# EAGLE design control (EAGLE 6.6.0)
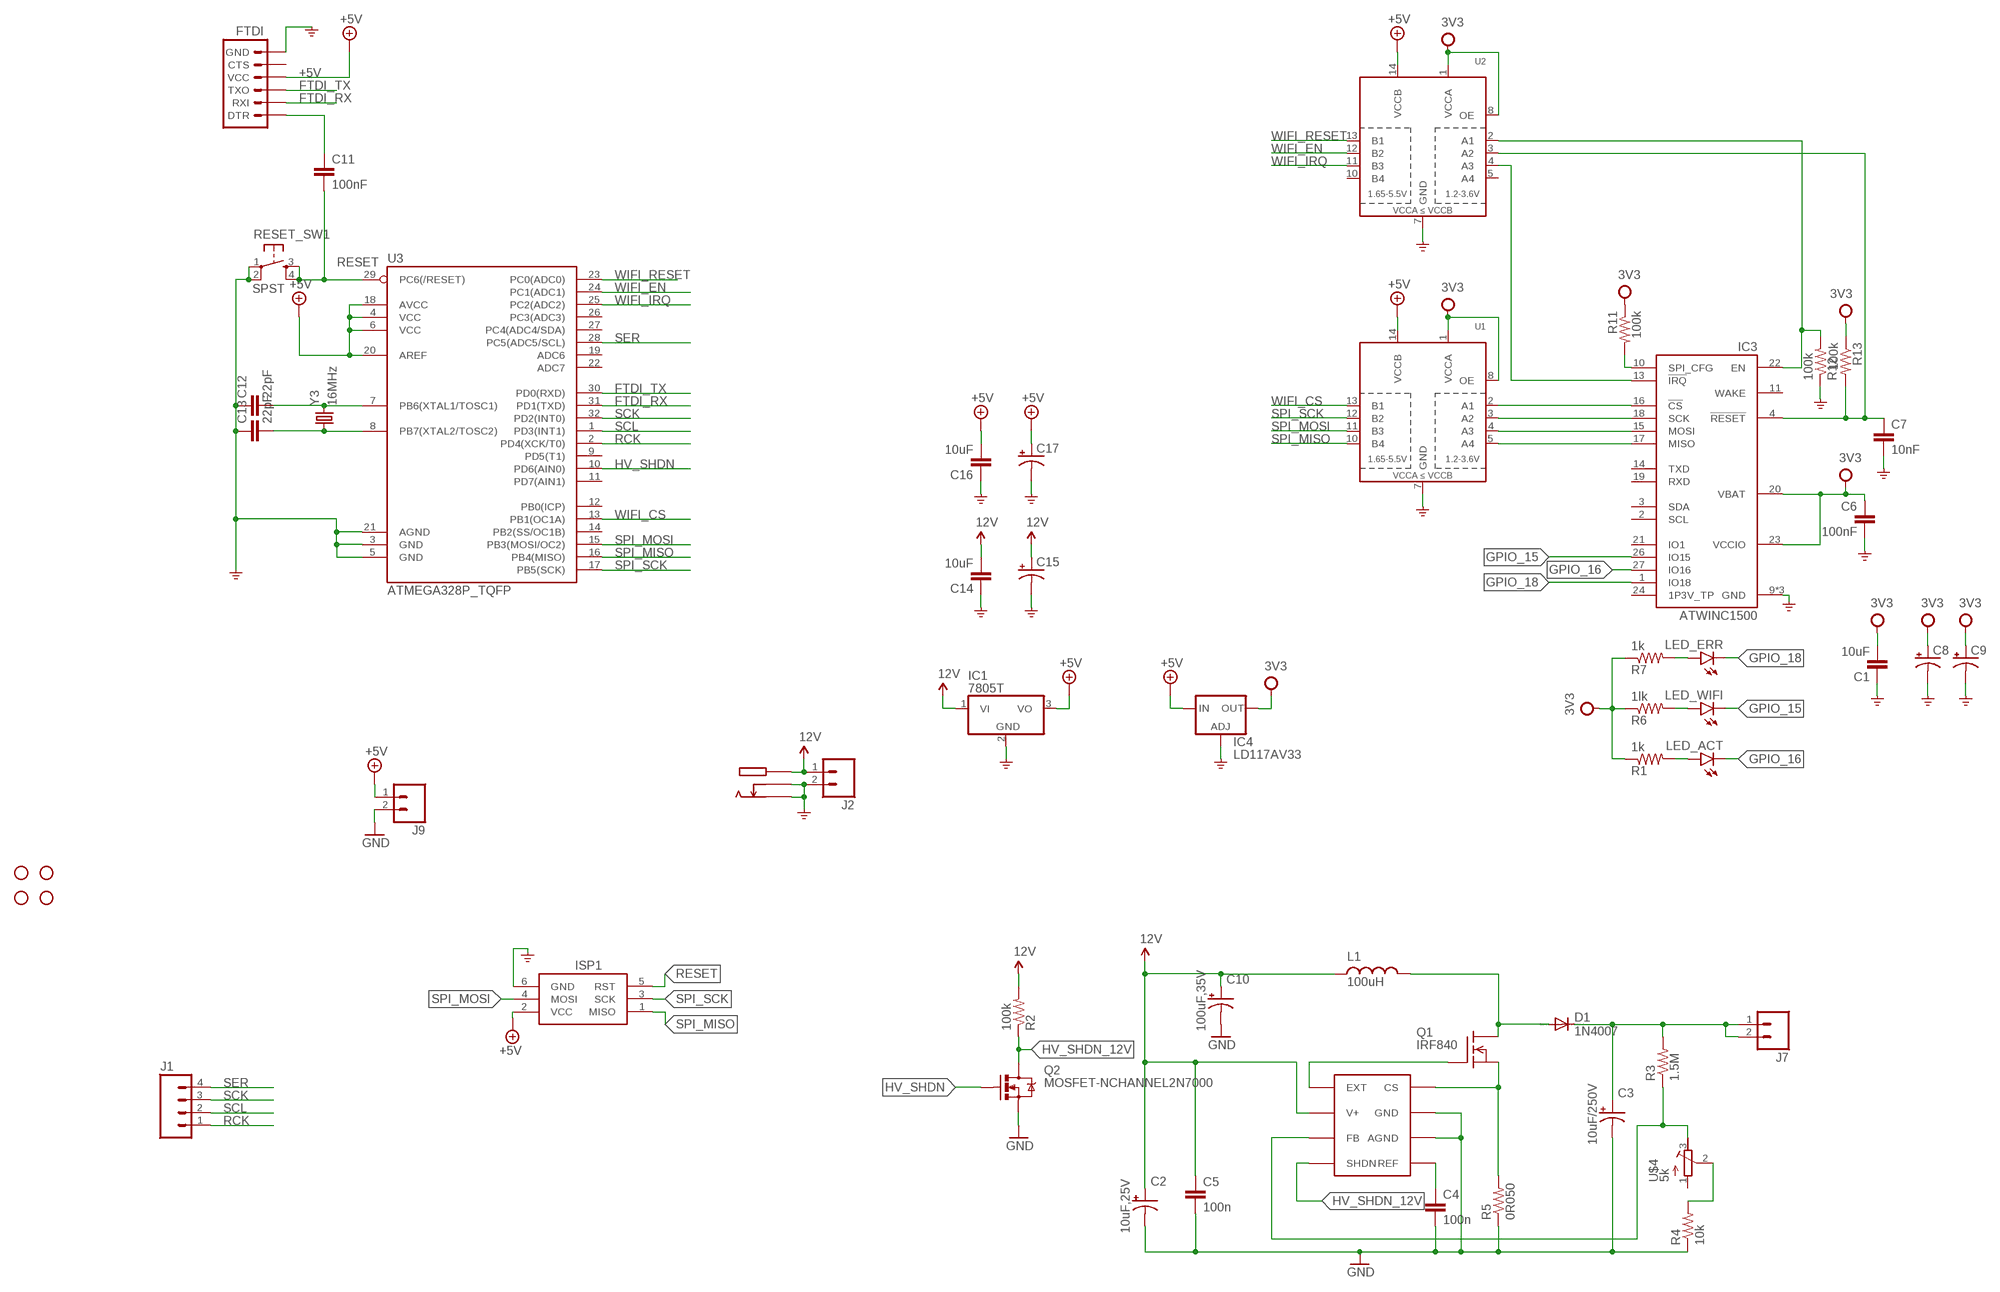
[diagram p0: schematic, sheet 1]

## Parts
C1  10uF  CAP0805  [0805]
C2  10uF,25V  CAP_POLPTH2  [CPOL-RADIAL-10UF-25V]
C3  10uF/250V  CAP_POLPTH2  [CPOL-RADIAL-10UF-25V]
C4  100n  CAPPTH  [CAP-PTH-SMALL]
C5  100n  CAPPTH  [CAP-PTH-SMALL]
C6  100nF  CAP0805  [0805]
C7  10nF  CAP0805  [0805]
C8  CPOL-USE2,5-6E  [E2,5-6E]
C9  CPOL-USE2,5-6E  [E2,5-6E]
C10  100uF,35V  CAP_POLPTH2  [CPOL-RADIAL-10UF-25V]
C11  100nF  CAP0805  [0805]
C12  22pF  CAP0805  [0805]
C13  22pF  CAP0805  [0805]
C14  10uF  CAP0805  [0805]
C15  CPOL-USE2,5-6E  [E2,5-6E]
C16  10uF  CAP0805  [0805]
C17  CPOL-USE2,5-6E  [E2,5-6E]
D1  1N4007  1N4004  [DO41-10]
FTDI  ARDUINO_SERIAL_PROGRAMPTH  [1X06]
H1  STAND-OFF  [STAND-OFF]
H2  STAND-OFF  [STAND-OFF]
H3  STAND-OFF  [STAND-OFF]
H4  STAND-OFF  [STAND-OFF]
IC1  7805T  [TO220H]
IC3  ATWINC1500  [ATWINC1500-MR210]
IC4  LD117AV33  [TO220L1]
ISP1  AVRISP-6  [AVRISP]
J1  M04PTH  [1X04]
J2  M02PTH  [1X02]
J7  M02PTH  [1X02]
J9  M02PTH  [1X02]
L1  100uH  L-SMT-POWER-B82479  [L-B82479]
LED_ACT  LED0603  [LED-0603]
LED_ERR  LED0603  [LED-0603]
LED_WIFI  LED0603  [LED-0603]
Q1  IRF840  [TO220]
Q2  MOSFET-NCHANNEL2N7000  [TO-92]
R1  1k  RESISTOR0805-RES  [0805]
R2  100k  RESISTOR0805-RES  [0805]
R3  1.5M  RESISTORPTH-1/4W  [AXIAL-0.4]
R4  10k  RESISTORPTH-1/4W  [AXIAL-0.4]
R5  0R050  RESISTORPTH-1/4W  [AXIAL-0.4]
R6  1lk  RESISTOR0805-RES  [0805]
R7  1k  RESISTOR0805-RES  [0805]
R11  100k  RESISTOR0805-RES  [0805]
R12  100k  RESISTOR0805-RES  [0805]
R13  100k  RESISTOR0805-RES  [0805]
RESET_SW1  SPST  TACTILE-SWITCH-PTH  [TAC-SWITCH-PTH]
U1  TXB0104PWRSOIC14  [SO14]
U2  TXB0104PWRSOIC14  [SO14]
U3  ATMEGA328P_TQFP  [TQFP32-08]
U$3  MAX1771  [8-DIP]
U$4  5k  RTRIM-3362P  [RTRIM3362P]
U$19  PJ-044A  [PJ-044A]
Y3  16MHz  CRYSTALHC49US  [HC49US]

## Nets
12V: C2.1(+) C5.1 C10.1(+) C14.2 C15.+ IC1.1(VI) J2.1 L1.P$1 R2.2 U$3.V+ U$19.1 U$19.P1
+3V3: C1.2 C6.1 C8.+ C9.+ IC3.20(VBAT) IC3.23(VCCIO) IC4.2(OUT) R1.1 R6.1 R7.1 R11.1 R13.1 U1.1(VCCA) U1.8(OE) U2.1(VCCA) U2.8(OE) ; supply symbol labelled 3V3
+5V: C16.2 C17.+ FTDI.4(VCC) IC1.3(VO) IC4.3(IN) ISP1.2(VCC) J9.1 U1.14(VCCB) U2.14(VCCB) U3.4(VCC) U3.6(VCC) U3.18(AVCC) U3.20(AREF)
EXT1: Q1.1(G) U$3.EXT
FTDI_RX: FTDI.2(RXI) U3.31(PD1(TXD))
FTDI_TX: FTDI.3(TXO) U3.30(PD0(RXD))
GND: C1.1 C2.2(-) C3.2(-) C4.2 C5.2 C6.2 C7.2 C8.- C9.- C10.2(-) C12.1 C13.1 C14.1 C15.- C16.1 C17.- FTDI.6(GND) IC1.2(GND) IC3.9(GND) IC3.12(GND) IC3.28(GND) IC4.1(ADJ) ISP1.6(GND) J2.2 J9.2 Q2.1(S) R4.P$1 R5.P$1 R12.1 RESET_SW1.1 RESET_SW1.2 U1.7(GND) U2.7(GND) U3.3(GND) U3.5(GND) U3.21(AGND) U$3.AGND U$3.GND U$19.2 U$19.3 U$19.P2 U$19.P3
GPIO_15: IC3.26(IO15) LED_WIFI.C
GPIO_16: IC3.27(IO16) LED_ACT.C
GPIO_18: IC3.1(IO18) LED_ERR.C
HV_GEIGER [power]: C3.1(+) D1.C J7.1 J7.2 R3.P$2
HV_SHDN: Q2.2(G) U3.10(PD6(AIN0))
HV_SHDN_12V: Q2.3(D) R2.1 U$3.SHDN
N$1: R3.P$1 U$3.FB U$4.3
N$2 [power]: D1.A L1.P$2 Q1.2(D)
N$3: Q1.3(S) R5.P$2 U$3.CS
N$4: C4.1 U$3.REF
N$5: R4.P$2 U$4.2
N$9: LED_ACT.A R1.2
N$10: IC3.10(SPI_CFG) R11.2
N$11: LED_WIFI.A R6.2
N$12: LED_ERR.A R7.2
N$13: IC3.16(!CS) U1.2(A1)
N$14: IC3.18(SCK) U1.3(A2)
N$15: IC3.15(MOSI) U1.4(A3)
N$16: IC3.17(MISO) U1.5(A4)
N$17: IC3.13(!IRQ) U2.4(A3)
N$19: IC3.22(EN) R12.2 U2.2(A1)
N$20: C12.2 U3.7(PB6(XTAL1/TOSC1)) Y3.2
N$21: C13.2 U3.8(PB7(XTAL2/TOSC2)) Y3.1
N$22: C7.1 IC3.4(!RESET) R13.2 U2.3(A2)
N$37: C11.1 FTDI.1(DTR)
RCK: J1.1 U3.2(PD4(XCK/T0))
RESET: C11.2 ISP1.5(RST) RESET_SW1.3 RESET_SW1.4 U3.29(PC6(/RESET))
SCK: J1.3 U3.32(PD2(INT0))
SCL: J1.2 U3.1(PD3(INT1))
SER: J1.4 U3.28(PC5(ADC5/SCL))
SPI_MISO: ISP1.1(MISO) U1.10(B4) U3.16(PB4(MISO))
SPI_MOSI: ISP1.4(MOSI) U1.11(B3) U3.15(PB3(MOSI/OC2))
SPI_SCK: ISP1.3(SCK) U1.12(B2) U3.17(PB5(SCK))
WIFI_CS: U1.13(B1) U3.13(PB1(OC1A))
WIFI_EN: U2.12(B2) U3.24(PC1(ADC1))
WIFI_IRQ: U2.11(B3) U3.25(PC2(ADC2))
WIFI_RESET: U2.13(B1) U3.23(PC0(ADC0))
Unconnected: FTDI.5(CTS) IC3.2(SCL) IC3.3(SDA) IC3.11(WAKE) IC3.14(TXD) IC3.19(RXD) IC3.21(IO1) IC3.24(1P3V_TP) U2.5(A4) U2.10(B4) U3.9(PD5(T1)) U3.11(PD7(AIN1)) U3.12(PB0(ICP)) U3.14(PB2(SS/OC1B)) U3.19(ADC6) U3.22(ADC7) U3.26(PC3(ADC3)) U3.27(PC4(ADC4/SDA)) U$4.1

## Library data of the parts
C1 C6 C7 C11-C14 C16 = SparkFun-Capacitors:CAP: Capacitor Standard 0603 ceramic capacitor, and 0.1" leaded capacitor.
C2 C3 C10 = SparkFun-Capacitors:CAP_POL: Capacitor Polarized These are standard SMD and PTH capacitors. Normally 10uF, 47uF, and 100uF in electrolytic and tantalum varieties. Always verify the external diameter of the through hole cap, it varies with capacity, voltage, and manufacturer. The EIA devices should be standard.
C4 C5 = SparkFun-Passives:CAP: Capacitor Standard 0603 ceramic capacitor, and 0.1" leaded capacitor.
C8 C9 C15 C17 = resistor:CPOL-US: POLARIZED CAPACITOR, American symbol
D1 = diode:1N4004: DIODE general purpose rectifier, 1 A
FTDI = SparkFun-Connectors:ARDUINO_SERIAL_PROGRAM: FTDI connector footprints
H1-H4 = SparkFun-Electromechanical:STAND-OFF: #4 Stand Off This is the mechanical footprint for a #4 phillips button head screw. Use the keepout ring to avoid running the screw head into surrounding components. SKU : PRT-00447
IC1 = linear:78*: Positive VOLTAGE REGULATOR Source: http://cache.national.com/ds/LM/LM78L05.pdf http://www.fairchildsemi.com/ds/LM/LM7805.pdf
IC3 = we-chip:ATWINC1500: Atmel ATWINC1500-MR210 WiFi/WLAN 802.11 b/g/n
IC4 = v-reg:LD117A?*: Low drop fixed and adjustable positive voltage regulators 1 A Source: http://www.st.com/stonline/products/literature/ds/7194/ld1117axx.pdf
ISP1 = adafruit:AVRISP: AVR ISP HEADER Standard 6 pin header for AVR programming
J1 = SparkFun-Connectors:M04: Header 4 Standard 4-pin 0.1" header. Use with straight break away headers (SKU : PRT-00116), right angle break away headers (PRT-00553), swiss pins (PRT-00743), machine pins (PRT-00117), and female headers (PRT-00115). Molex polarized connector foot print use with SKU : PRT-08231 with associated crimp pins and housings. 1MM SMD Version SKU: PRT-10208; PROD_ID: CONN-09696
J2 J7 J9 = SparkFun-Connectors:M02: Standard 2-pin 0.1" header. Use with - straight break away headers ( PRT-00116) - right angle break away headers (PRT-00553) - swiss pins (PRT-00743) - machine pins (PRT-00117) - female headers (PRT-00115) Molex polarized connector foot print use with: PRT-08233 with associated crimp pins and housings. 2.54_SCREWTERM for use with PRT-10571. 3.5mm Screw Terminal footprints for PRT-08084 5mm Screw Terminal footprints for use with PRT-08432
L1 = nick:L-SMT-POWER: SMT power inductors
LED_ACT LED_ERR LED_WIFI = SparkFun-LED:LED: LEDs Standard schematic elements and footprints for 5mm, 3mm, 1206, and 0603 sized LEDs. 5mm - Spark Fun Electronics SKU : COM-00529 (and others)
Q1 = transistor-fet:IRF840: N-Channel Enhancement MOSFET (HEXFET); 500V; 8A; 0,85Ohm
Q2 = SparkFun-DiscreteSemi:MOSFET-NCHANNEL: Common NMOSFET Parts MFG P/N Store ID Prod ID FDD8780 TRANS-09984 SI7820DN TRANS-11055 FDS6630A IC-08089 2N7002PW TRANS-11151 FQP30N06L COM-10213 TRANS-10060 BSS123LT1G TRANS-08345 BSS138 TRANS-00830 BS170 2N7000
R1-R7 R11-R13 = SparkFun-Passives:RESISTOR: Resistor Basic schematic elements and footprints for 0603, 1206, and PTH resistors.
RESET_SW1 = GeekAmmo:TACTILE-SWITCH: Tactile Switch 4 Pins, SPST NO
U1 U2 = SparkFun-DigitalIC:TXB0104PWR: 4-Bit Bi-Directional Level Shifter 1.2V-3.6V (VCCA) to 1.65V-5.5V (VCCB) bi-directional level shifter with auto direction sensing. Max data rate - VCCA 1.8V: 20Mbps (50ns), VCCA 3.3V: 100Mbps (10ns) Digikey: 296-21929-1-ND (TSSOP) IC-11329; PROD_ID: IC-11329
U3 = SparkFun-DigitalIC:ATMEGA328P_TQFP; PROD_ID: IC-09069
U$3 = max1771:MAX1771
U$4 = GeekAmmo:RTRIM: BOURNS 3362 - 1/4" Square Trimpot® Trimming Potentiometer
U$19 = Passives:PJ-044A
Y3 = SparkFun-FreqCtrl:CRYSTAL: Various standard crystals. Proven footprints.

## Net classes
1 power: width 0.762 mm, clearance 0.508 mm

## Board
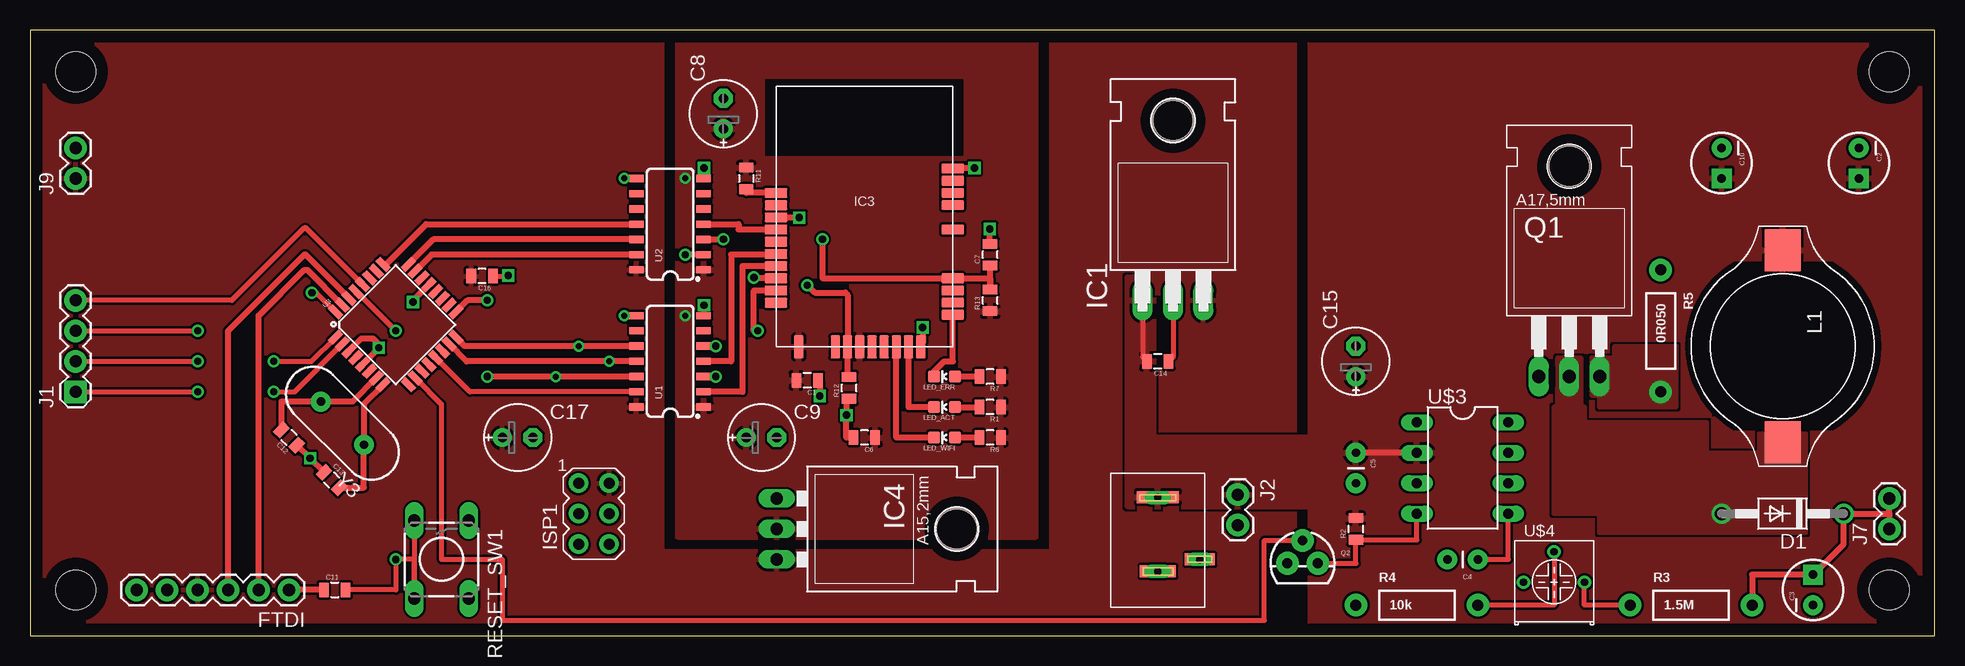
[diagram p1: board, top side]
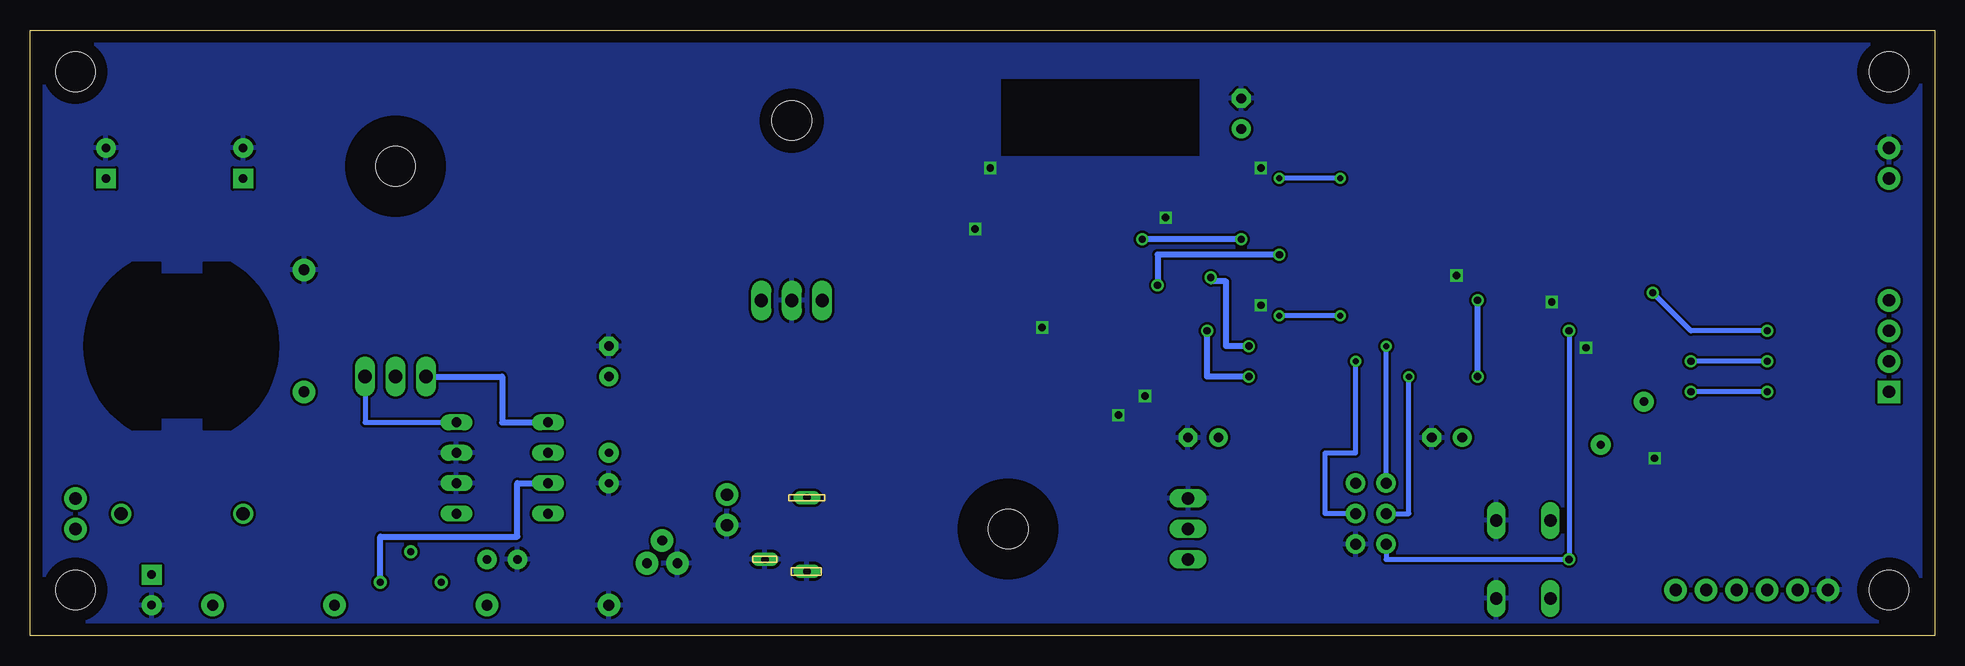
[diagram p2: board, bottom side, seen from below]

Size 158.73 x 50.47 mm. Coordinates in mm from the lower left corner, seen from the top.
Outline: 0,0 158.73,0 158.73,50.47 0,50.47 0,0
Copper layers (1*16): Top 0.035mm / dielectric 1.5mm / Bottom 0.035mm
Design rules "default *": minimum track width 10mil, minimum drill 12mil, track to track 8mil, track to pad 8mil, pad to pad 8mil, via to via 8mil, smd to smd 8mil, copper to edge 40mil, drill to drill 8mil, minimum pad ring 10mil, minimum via ring 8mil, stop-mask expansion 4mil, vias tented up to drill 0mil, thermal gap 10mil

### Footprints (pad centres in the part's own frame; a part is rotated, then mirrored left to right if it is on the bottom)
0805 = smd 0.8 x 1.2: 1 -0.9,0; 2 0.9,0
CPOL-RADIAL-10UF-25V = drill 0.7 pad 1.651 square: 1 1.27,0 | drill 0.7 pad 1.651: 2 -1.27,0
CAP-PTH-SMALL = drill 0.7 pad 1.651: 1 0,0; 2 2.54,0
E2,5-6E = drill 0.813 pad 1.575: + -1.27,0 | drill 0.813 pad 1.575 octagon: - 1.27,0
DO41-10 = drill 1.118: A 5.08,0; C -5.08,0
1X06 = drill 1.016 pad 1.88: 1 0,0; 2 2.54,0; 3 5.08,0; 4 7.62,0; 5 10.16,0; 6 12.7,0
STAND-OFF = hole 3.302: 0,0
TO220H = drill 1.118 long: 1 -2.54,-10.16; 2 0,-10.16; 3 2.54,-10.16 | hole 3.302: 0,4.826
ATWINC1500-MR210 = smd 1.9 x 0.8: 1 7.365,-8.19; 2 7.365,-7.174; 3 7.365,-6.158; 4 7.365,-5.142; 5 7.365,-1.078; 6 7.365,0.954; 7 7.365,1.97; 8 7.365,2.986; 9 7.365,4.002; 10 -7.365,1.964; 11 -7.365,0.948; 12 -7.365,-0.068; 13 -7.365,-1.084; 14 -7.365,-2.1; 15 -7.365,-3.116; 16 -7.365,-4.132; 17 -7.365,-5.148; 18 -7.365,-6.164; 19 -7.365,-7.18 | smd 0.8 x 1.9: 20 -5.465,-10.86; 21 -2.417,-10.86; 22 -1.401,-10.86; 23 -0.385,-10.86; 24 0.631,-10.86; 25 1.647,-10.86; 26 2.663,-10.86; 27 3.679,-10.86; 28 4.695,-10.86
TO220L1 = drill 1.016 long: 1 -2.54,-3.81; 2 0,-3.81; 3 2.54,-3.81 | hole 3.302: 0,11.176
AVRISP = drill 0.9 pad 1.626: 1 -1.27,2.54; 2 1.27,2.54; 3 -1.27,0; 4 1.27,0; 5 -1.27,-2.54; 6 1.27,-2.54
1X04 = drill 1.016 pad 1.88 square: 1 0,0 | drill 1.016 pad 1.88: 2 2.54,0; 3 5.08,0; 4 7.62,0
1X02 = drill 1.016 pad 1.88: 1 0,0; 2 2.54,0
L-B82479 = smd 3.5 x 3: P$1 -8,0; P$2 8,0
LED-0603 = smd 1 x 1: A 0,-0.877; C 0,0.877
TO220 = drill 1.118 long: 1 -2.54,-6.35; 2 0,-6.35; 3 2.54,-6.35 | hole 3.302: 0,11.176
TO-92 = drill 0.813 pad 1.88: 1 -1.27,0; 2 0,1.905; 3 1.27,0
AXIAL-0.4 = drill 0.9 pad 1.88: P$1 -5.08,0; P$2 5.08,0
TAC-SWITCH-PTH = drill 1.016 pad 1.524 long: 1 -3.251,2.261; 2 3.251,2.261; 3 -3.251,-2.261; 4 3.251,-2.261
SO14 = smd 0.6 x 1.2: 1 -3.81,-2.8; 2 -2.54,-2.8; 3 -1.27,-2.8; 4 0,-2.8; 5 1.27,-2.8; 6 2.54,-2.8; 7 3.81,-2.8; 8 3.81,2.8; 9 2.54,2.8; 10 1.27,2.8; 11 0,2.8; 12 -1.27,2.8; 13 -2.54,2.8; 14 -3.81,2.8
TQFP32-08 = smd 1.27 x 0.559: 1 -4.293,2.8; 2 -4.293,2; 3 -4.293,1.2; 4 -4.293,0.4; 5 -4.293,-0.4; 6 -4.293,-1.2; 7 -4.293,-2; 8 -4.293,-2.8; 17 4.293,-2.8; 18 4.293,-2; 19 4.293,-1.2; 20 4.293,-0.4; 21 4.293,0.4; 22 4.293,1.2; 23 4.293,2; 24 4.293,2.8 | smd 0.559 x 1.27: 9 -2.8,-4.293; 10 -2,-4.293; 11 -1.2,-4.293; 12 -0.4,-4.293; 13 0.4,-4.293; 14 1.2,-4.293; 15 2,-4.293; 16 2.8,-4.293; 25 2.8,4.293; 26 2,4.293; 27 1.2,4.293; 28 0.4,4.293; 29 -0.4,4.293; 30 -1.2,4.293; 31 -2,4.293; 32 -2.8,4.293
8-DIP = drill 0.813 long: AGND 6.35,3.81; CS 1.27,3.81; EXT 1.27,-3.81; FB 6.35,-3.81; GND 3.81,3.81; REF 8.89,3.81; SHDN 8.89,-3.81; V+ 3.81,-3.81
RTRIM3362P = drill 0.6: 1 -2.54,-2.54; 2 0,0; 3 2.54,-2.54
PJ-044A = smd 3.5 x 1: 1 0,5.2 | smd 3 x 1: 2 0,-1 | smd 2.5 x 1: 3 3.5,0 | drill 0.61 long: P1 0,5.16; P2 0,-1; P3 3.5,0
HC49US = drill 0.7 pad 1.651: 1 -2.54,0; 2 2.54,0

### Placement (x,y rotation side)
C1  64.77,21.27 180 top
C2  152.4,39.37 270 top
C3  148.59,3.81 90 top
C4  120.65,6.35 180 top
C5  110.49,15.24 270 top
C6  69.53,16.51 180 top
C7  80.01,31.75 90 top
C8  57.79,43.5 90 top
C9  60.96,16.51 0 top
C10  140.97,39.37 270 top
C11  25.4,3.81 0 top
C12  21.59,16.51 135 top
C13  25.14,12.96 315 top
C14  93.98,22.86 180 top
C15  110.49,22.86 90 top
C16  37.67,29.97 180 top
C17  40.64,16.51 0 top
D1  146.05,10.16 180 top
FTDI  21.59,3.81 180 top
H1  3.81,3.81 0 top
H2  154.94,46.99 0 top
H3  154.94,3.81 0 top
H4  3.81,46.99 0 top
IC1  95.25,38.1 0 top
IC3  69.53,34.92 0 top
IC4  66.04,8.89 270 top
ISP1  46.99,10.16 0 top
J1  3.81,20.32 90 top
J2  100.65,11.75 270 top
J7  154.94,8.89 90 top
J9  3.81,38.1 90 top
L1  146.05,24.13 270 top
LED_ACT  76.2,19.05 90 top
LED_ERR  76.2,21.59 90 top
LED_WIFI  76.2,16.51 90 top
Q1  128.27,27.94 0 top
Q2  106.05,6.03 0 top
R1  80.01,19.05 180 top
R2  110.49,8.89 90 top
R3  138.43,2.54 0 top
R4  115.57,2.54 0 top
R5  135.89,25.4 270 top
R6  80.01,16.51 180 top
R7  80.01,21.59 180 top
R11  59.69,38.1 270 top
R12  68.26,20.64 90 top
R13  80.01,27.94 90 top
RESET_SW1  34.29,6.35 270 top
U1  53.34,22.86 90 top
U2  53.34,34.29 90 top
U3  30.48,25.93 45 top
U$3  119.38,19.05 270 top
U$4  127,6.99 0 top
U$19  93.98,6.35 0 top
Y3  26.03,17.7 135 top

### Tracks (layer width: path | path; a pad name or v marks a point on that pad's centre or on a via)
12V
  Top 0.406: IC1.1 92.71,23.23 C14.2
  Top 0.508: U$3.V+ C5.1
  pour Top (rank 5): 106.68,0 158.75,0 158.75,50.8 106.68,50.8 106.68,16.51 93.66,16.51 93.66,29.84 91.44,29.84 91.44,10.79 106.68,10.79
+3V3  (via drill 0.51)
  Top 0.406: U1.8 v49.53,26.67 | U2.8 v49.53,38.1
  Bottom 0.406: v49.53,26.67 v54.61,26.67 | v49.53,38.1 v54.61,38.1
  pour Top (rank 6): 53.98,8.26 83.82,8.26 83.82,49.53 53.98,49.53
+5V
  pour Top (rank 6): 0,0 105.41,0 105.41,49.53 85.09,49.53 85.09,6.99 52.71,6.99 52.71,50.8 0,50.8
EXT1
  Bottom 0.508: Q1.1 119.38,21.59 119.38,17.78 U$3.EXT
FTDI_RX
  Top 0.508: FTDI.2 19.05,26.67 22.86,30.48 23.1,30.48 U3.31
FTDI_TX
  Top 0.508: FTDI.3 16.51,25.4 22.86,31.75 22.96,31.75 U3.30
GND  (via drill 0.61)
  Top 0.406: C16.1 39.81,29.97 v39.86,30.02 | IC1.2 95.25,23.23 C14.1
  Top 0.508: C12.1 22.25,15.87 v23.34,14.78 23.34,14.76 C13.1 | C7.2 79.97,32.65 v79.97,33.88 | v74.38,25.68 74.38,24.38 IC3.28 | C1.1 65.81,21.27 v65.81,19.96 | R12.1 68.03,19.74 v68.03,18.38 68.03,16.51 C6.2 | v78.7,38.96 76.9,38.96 IC3.9 | IC3.12 64.1,34.86 v64.1,34.84 | v56.16,38.96 56.14,38.96 U2.7 | v56.16,27.53 56.14,27.53 U1.7 | v31.92,27.8 31.92,27.93 U3.21 | U3.5 29.06,23.94 v29.06,23.99 29.06,24.28 28.57,24.77 27.62,24.77 U3.3
  pour Bottom: 0,0 158.75,0 158.75,50.8 0,50.8
GPIO_15
  Top 0.508: LED_WIFI.C 72.2,16.51 IC3.26
GPIO_16
  Top 0.508: LED_ACT.C 73.21,19.05 IC3.27
GPIO_18
  Top 0.508: LED_ERR.C 75.32,21.98 76.2,22.86 76.9,22.86 IC3.1
HV_GEIGER
  Top 0.508: 154.94,10.16 D1.C 151.13,7.62 C3.1 143.51,5.08 R3.P$2 | 154.94,10.16 J7.2 | 154.94,10.16 J7.1
HV_SHDN
  Top 0.406: U3.10 34.29,19.29 34.29,6.35 39.37,6.35 39.37,1.27 102.87,1.27 102.87,7.94 Q2.2
HV_SHDN_12V
  Top 0.406: Q2.3 110.49,6.03 R2.1 115.57,7.99 U$3.SHDN
N$1
  Top 0.406: R3.P$1 129.54,2.54 U$4.3
  Bottom 0.508: U$4.3 129.54,8.26 118.11,8.26 118.11,12.7 U$3.FB
N$2
  pour Top (no thermals): 147.96,16.83 147.96,8.57 130.81,8.57 130.81,10.16 127,10.16 127,19.05 127.32,19.05 127.32,23.18 129.22,23.18 129.22,19.05 129.54,19.05 129.54,17.78 139.7,17.78 139.7,15.24 144.15,15.24 144.15,16.83
N$3
  Bottom 0.406: Q1.3 130.81,17.78 U$3.CS
  pour Top (no thermals): 137.16,19.05 130.81,19.05 130.81,20 130.17,20 130.17,23.18 132.08,23.18 132.08,24.13 137.16,24.13
N$4
  Top 0.406: C4.1 123.19,6.35 U$3.REF
N$5
  Top 0.406: U$4.2 127,2.54 R4.P$2
N$9
  Top 0.508: LED_ACT.A R1.2
N$10
  Top 0.508: IC3.10 59.69,36.89 R11.2
N$11
  Top 0.508: R6.2 LED_WIFI.A
N$12
  Top 0.508: R7.2 LED_ERR.A
N$13
  Top 0.508: IC3.16 59.37,30.79 59.37,20.32 U1.2
N$14  (via drill 0.6)
  Top 0.508: U1.3 v57.15,21.59 | v60.64,25.4 60.33,25.4 60.33,28.76 IC3.18
  Bottom 0.508: v57.15,21.59 60.64,21.59 v60.64,25.4
N$15
  Top 0.508: IC3.15 62.17,31.75 58.42,31.75 58.42,22.86 U1.4
N$16  (via drill 0.6)
  Top 0.508: U1.5 v57.15,24.13 | v60.33,29.84 62.17,29.84 IC3.17
  Bottom 0.508: v57.15,24.13 59.05,24.13 59.05,29.53 60.33,29.53 v60.33,29.84
N$17
  Top 0.508: U2.4 59.05,34.29 59.05,33.84 IC3.13
N$19  (via drill 0.6)
  Top 0.508: R12.2 68.13,21.54 IC3.22 68.13,28.39 67.95,28.57 65.41,28.57 v64.77,29.21 | U2.2 v54.61,31.75
  Bottom 0.508: v54.61,31.75 64.77,31.75 v64.77,29.21
N$20
  Top 0.508: U3.7 26.88,19.5 Y3.2 20.95,19.5 C12.2
N$21
  Top 0.508: U3.8 27.83,19.32 Y3.1 27.83,12.33 C13.2
N$22  (via drill 0.6)
  Top 0.508: C7.1 R13.2 80.01,29.78 IC3.4 66.04,29.78 v66.04,33.02 | U2.3 v57.79,33.02
  Bottom 0.508: v57.79,33.02 v66.04,33.02
N$37
  Top 0.508: C11.1 FTDI.1
RCK  (via drill 0.6)
  Top 0.406: J1.1 v13.97,20.32 | v20.32,20.32 22.05,20.32 U3.2
  Bottom 0.406: v13.97,20.32 v20.32,20.32
RESET  (via drill 0.6)
  Top 0.406: C11.2 30.48,3.81 v30.48,6.35 32.03,6.35 RESET_SW1.4 RESET_SW1.3 | 27.2,28.68 v30.48,25.4
  Top 0.508: U3.29 27.2,28.68
  Bottom 0.406: v30.48,25.4 v30.48,6.35 45.72,6.35 ISP1.5
SCK  (via drill 0.6)
  Top 0.406: J1.3 v13.97,25.4 | v23.49,28.57 23.87,28.57 U3.32
  Bottom 0.406: v13.97,25.4 20.32,25.4 v23.49,28.57
SCL  (via drill 0.6)
  Top 0.406: J1.2 v13.97,22.86 | v20.32,22.86 23.45,22.86 U3.1
  Bottom 0.406: v13.97,22.86 v20.32,22.86
SER
  Top 0.406: U3.28 23,33.97 22.86,33.97 16.83,27.94 J1.4
SPI_MISO  (via drill 0.51)
  Top 0.508: U1.10 v45.72,24.13 36.24,24.13 U3.16
  Bottom 0.406: ISP1.1 v45.72,24.13
SPI_MOSI  (via drill 0.51)
  Top 0.508: U1.11 v48.26,22.86 36.37,22.86 U3.15
  Bottom 0.406: ISP1.4 50.8,10.16 50.8,15.24 48.26,15.24 v48.26,22.86
SPI_SCK  (via drill 0.51, 0.6)
  Top 0.508: U1.12 v43.82,21.59 v38.1,21.59 | v38.1,27.94 36.45,27.94 U3.17
  Bottom 0.406: ISP1.3 43.82,10.16 v43.82,21.59
  Bottom 0.508: v38.1,21.59 v38.1,27.94
WIFI_CS
  Top 0.406: U1.13 36.65,20.32 U3.13
WIFI_EN
  Top 0.508: U2.12 33.61,33.02 U3.24
WIFI_IRQ
  Top 0.508: U3.25 29.67,30.94 33.02,34.29 U2.11
WIFI_RESET
  Top 0.508: U2.13 33.48,31.75 U3.23